# Altium schematic sheet HLK-W806-KIT-V1.0.SchDoc
size A4
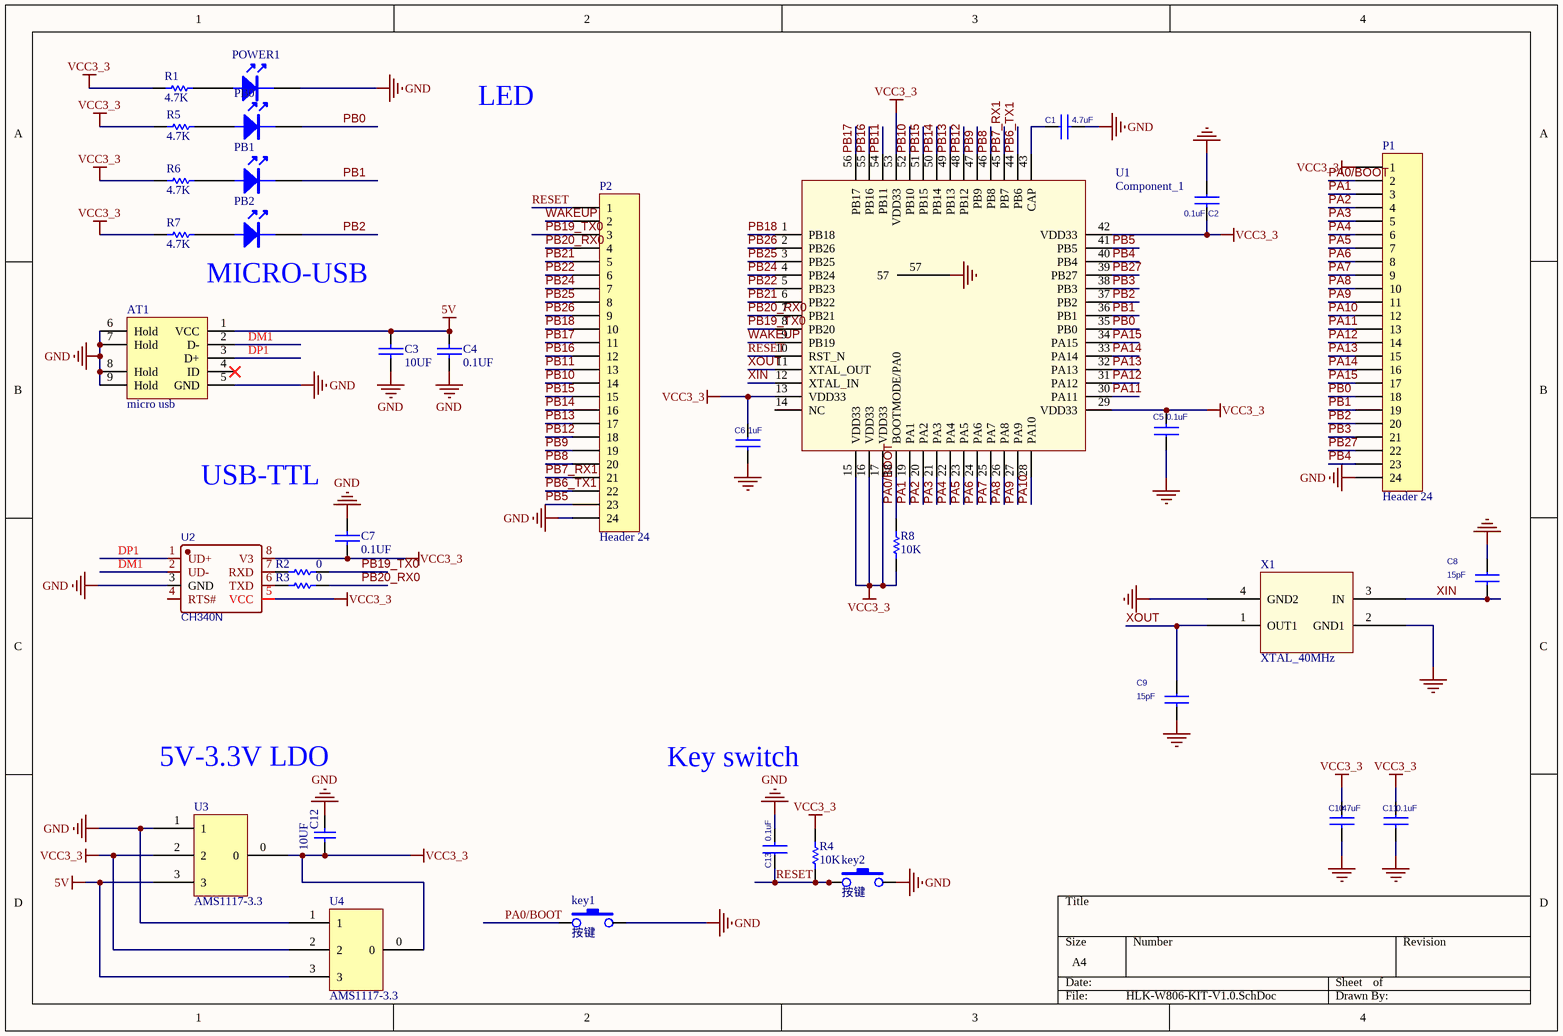
[diagram p0: HLK-W806-KIT-V1.0.SchDoc]

## Parts
AT1  micro usb  [USB-MICRO_D]
C1  4.7uF  [0603]
C2  0.1uF  [0603]
C3  10UF  [0603_1]
C4  0.1UF  [0603_1]
C5  0.1uF  [0603]
C6  1uF  [0603]
C7  0.1UF  [0603_1]
C8  15pF  [0603]
C9  15pF  [0603]
C10  47uF  [R0805]
C11  0.1uF  [0603]
C12  10UF  [0603_1]
C13  0.1uF  [0603]
key1  按键  [正按小龟]
key2  按键  [正按小龟]
P1  Header 24  [HDR1X24]
P2  Header 24  [HDR1X24]
PB0  (no value)  [0603LED]
PB1  (no value)  [0603LED]
PB2  (no value)  [0603LED]
POWER1  (no value)  [0603LED]
R1  4.7K  [0603_1]
R2  0  [0603_1]
R3  0  [0603_1]
R4  10K  [0603_1]
R5  4.7K  [0603_1]
R6  4.7K  [0603_1]
R7  4.7K  [0603_1]
R8  10K  [0603_1]
U1  Component_1  [LCC56 - duplicate1]
U2  CH340N  [SOP8]
U3  AMS1117-3.3  [AMS1117]
U4  AMS1117-3.3  [SOT223]
X1  XTAL_40MHz  [SMD-3225]

## Nets
5V: AT1.1(VCC) C3.2 C4.2 U3.3 U4.3
GND: AT1.5(GND) AT1.6(Hold) AT1.7(Hold) AT1.8(Hold) AT1.9(Hold) C1.2 C2.1 C3.1 C4.1 C5.1 C6.2 C7.1 C8.1 C9.2 C10.2 C11.2 C12.1 C13.2 key1.2 key2.2 P1.24 P2.24 POWER1.2 U1.57 U2.3(GND) U3.1 U4.1 X1.2(GND1) X1.4(GND2)
VCC3_3: C2.2 C5.2 C6.1 C7.2 C10.1 C11.1 C12.2 P1.1 R1.1 R4.2 R5.1 R6.1 R7.1 R8.1 U1.13(VDD33) U1.15(VDD33) U1.16(VDD33) U1.17(VDD33) U1.29(VDD33) U1.42(VDD33) U1.53(VDD33) U2.5(VCC) U2.8(V3) U3.0 U3.2 U4.0 U4.2
DM1: AT1.2(D-) U2.2(UD-)
DP1: AT1.3(D+) U2.1(UD+)
PA0/BOOT: key1.1 P1.2 R8.2 U1.18(BOOTMODE/PA0)
PA1: P1.3 U1.19(PA1)
PA2: P1.4 U1.20(PA2)
PA3: P1.5 U1.21(PA3)
PA4: P1.6 U1.22(PA4)
PA5: P1.7 U1.23(PA5)
PA6: P1.8 U1.24(PA6)
PA7: P1.9 U1.25(PA7)
PA8: P1.10 U1.26(PA8)
PA9: P1.11 U1.27(PA9)
PA10: P1.12 U1.28(PA10)
PA11: P1.13 U1.30(PA11)
PA12: P1.14 U1.31(PA12)
PA13: P1.15 U1.32(PA13)
PA14: P1.16 U1.33(PA14)
PA15: P1.17 U1.34(PA15)
PB0: P1.18 PB0.2 U1.35(PB0)
PB1: P1.19 PB1.2 U1.36(PB1)
PB2: P1.20 PB2.2 U1.37(PB2)
PB3: P1.21 U1.38(PB3)
PB4: P1.23 U1.40(PB4)
PB5: P2.23 U1.41(PB5)
PB6_TX1: P2.22 U1.44(PB6)
PB7_RX1: P2.21 U1.45(PB7)
PB8: P2.20 U1.46(PB8)
PB9: P2.19 U1.47(PB9)
PB10: P2.14 U1.52(PB10)
PB11: P2.13 U1.54(PB11)
PB12: P2.18 U1.48(PB12)
PB13: P2.17 U1.49(PB13)
PB14: P2.16 U1.50(PB14)
PB15: P2.15 U1.51(PB15)
PB16: P2.12 U1.55(PB16)
PB17: P2.11 U1.56(PB17)
PB18: P2.10 U1.1(PB18)
PB19_TX0: P2.3 R2.2 U1.8(PB20)
PB20_RX0: P2.4 R3.2 U1.7(PB21)
PB21: P2.5 U1.6(PB22)
PB22: P2.6 U1.5(PB23)
PB24: P2.7 U1.4(PB24)
PB25: P2.8 U1.3(PB25)
PB26: P2.9 U1.2(PB26)
PB27: P1.22 U1.39(PB27)
RESET: C13.1 key2.1 P2.1 R4.1 U1.10(RST_N)
WAKEUP: P2.2 U1.9(PB19)
XIN: C8.2 U1.12(XTAL_IN) X1.3(IN)
XOUT: C9.1 U1.11(XTAL_OUT) X1.1(OUT1)
NetC1_1: C1.1 U1.43(CAP)
NetPB0_1: PB0.1 R5.2
NetPB1_1: PB1.1 R6.2
NetPB2_1: PB2.1 R7.2
NetPOWER1_1: POWER1.1 R1.2
NetR2_1: R2.1 U2.7(RXD)
NetR3_1: R3.1 U2.6(TXD)

Not connected (* = marked no-connect by the designer): AT1 4(ID)*; U1 14(NC); U2 4(RTS#)

## Notes on the sheet
- LED
- MICRO-USB
- USB-TTL
- 5V-3.3V LDO
- Key switch

## Library data of the parts
AT1 = USB-D
C1 C2 C5 C6 C8-C11 C13 = CAP NP_Dup1
C3 C4 C7 = CAP: Capacitor
C12 = Cap: Capacitor; Value: 100pF; Published: 8-Jun-2000; LatestRevisionDate: 17-Jul-2002; LatestRevisionNote: Re-released for DXP Platform.; PackageReference: RAD-0.3; Publisher: Altium Limited
P1 P2 = Header 24: Header, 24-Pin; LatestRevisionDate: 17-Jul-2002; LatestRevisionNote: Re-released for DXP Platform.; Publisher: Altium Limited
PB0-PB2 POWER1 = LED
R1-R8 = Res1: Resistor; Published: 8-Jun-2000; LatestRevisionDate: 17-Jul-2002; LatestRevisionNote: Re-released for DXP Platform.; PackageReference: AXIAL-0.3; Publisher: Altium Limited
  R1 R5-R7: Value: 4.7K
  R2 R3: Value: 0
  R4 R8: Value: 10K
U2 = CH340N: BOM_Manufacturer: WCH(Jiangsu Qin Heng); Contributor: LCSC; BOM_Supplier: LCSC; BOM_Supplier Part: C506813; BOM_Manufacturer Part: CH340N; BOM_JLCPCB Part Class: Extended Part; spicePre: U; spiceSymbolName: CH340N
U3 U4 = Component_1